# Altium project SPNEX_Payload.PrjPcb (part 3 of 3)
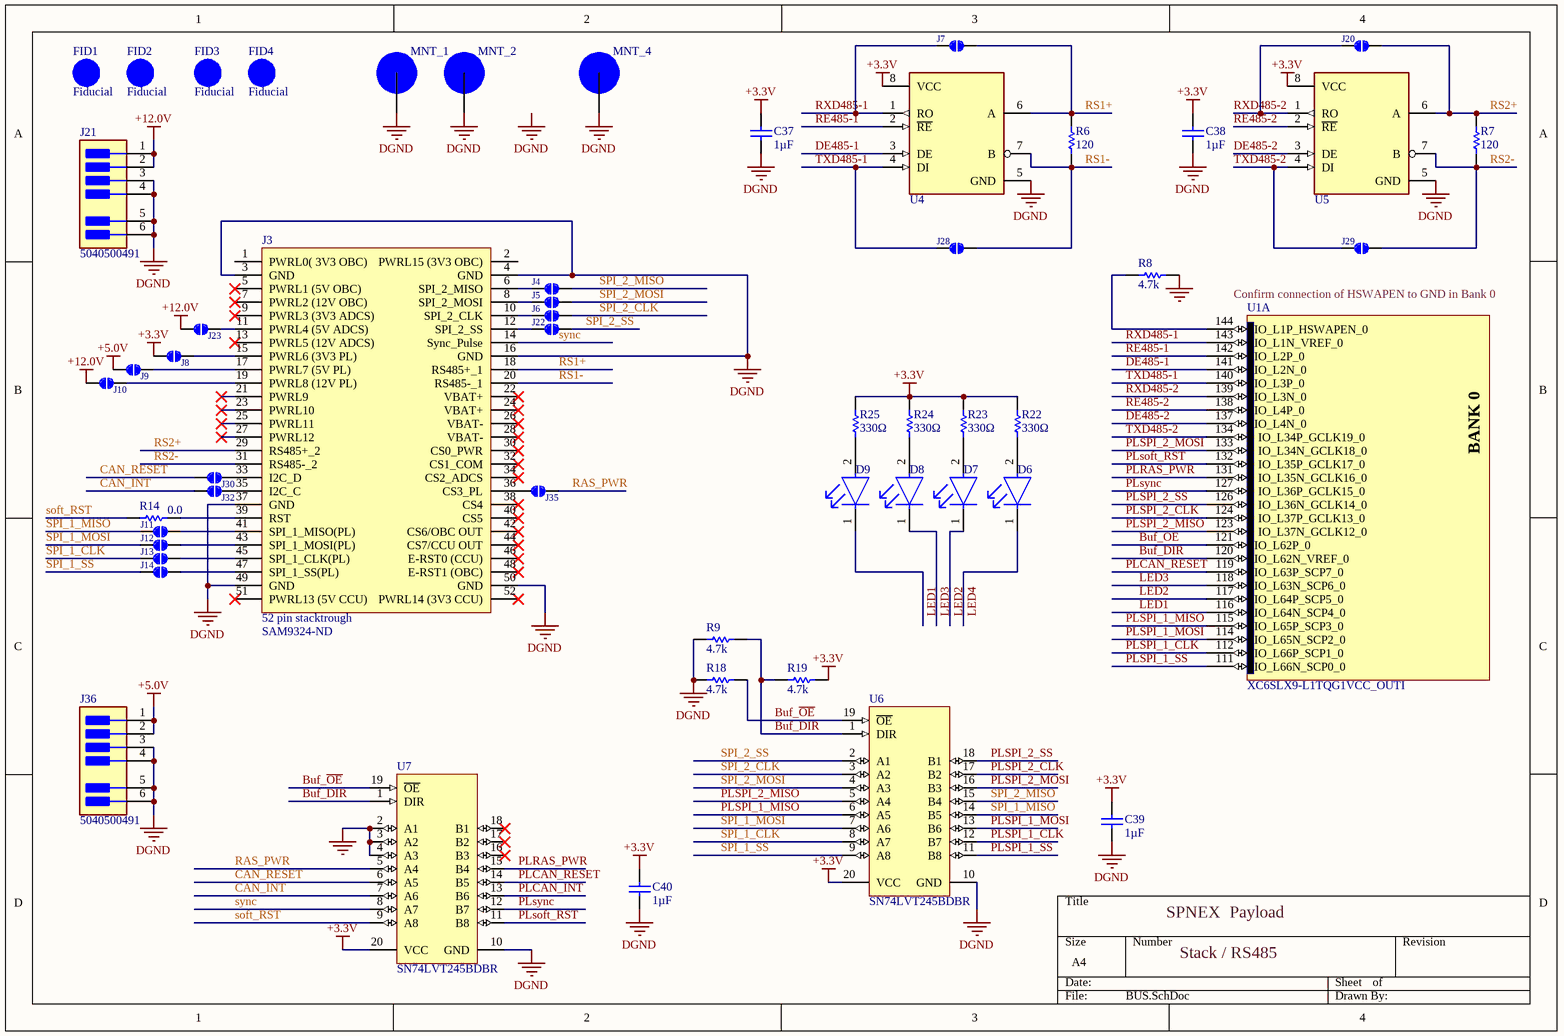
[diagram p6: BUS.SchDoc]

## Nets that join several sheets
+1.8V: FPGA Configuration (U11_FPGA_Configuration.4 U11_FPGA_Configuration.15 U11_FPGA_Configuration.34), Power (9 pins), Serial Camera (U11_Serial_Camera.4 U11_Serial_Camera.15 U11_Serial_Camera.34), SRAM (U11_SRAM.4 U11_SRAM.15 U11_SRAM.34)
+3.3V: FPGA Configuration (33 pins), Power (41 pins), LM Probe (J34_LM_Probe.1 R11_LM_Probe.2 U18_LM_Probe.5), Storage Memory (19 pins), Serial Camera (33 pins), BUS (14 pins), High Resolution Camera (J34_High_Resolution_Camera.1 R11_High_Resolution_Camera.2 U18_High_Resolution_Camera.5), SRAM (33 pins)
+5.0V: FPGA Configuration (J15_FPGA_Configuration.2 J17_FPGA_Configuration.2), Power (C1.2 R2.2), LM Probe (J40_LM_Probe.2), Serial Camera (J15_Serial_Camera.2 J17_Serial_Camera.2), BUS (J9.1 J36.1 J36.2), High Resolution Camera (J40_High_Resolution_Camera.2), SRAM (J15_SRAM.2 J17_SRAM.2)
+12.0V: Power (R1.2), LM Probe (J43_LM_Probe.2), BUS (J10.1 J21.1 J21.2 J23.1), High Resolution Camera (J43_High_Resolution_Camera.2)
DGND: FPGA Configuration (60 pins), Power (56 pins), LM Probe (14 pins), Storage Memory (18 pins), Serial Camera (60 pins), BUS (31 pins), High Resolution Camera (14 pins), SRAM (60 pins)
ADC_CNV: LM Probe (J33_LM_Probe.1 U1_LM_Probe.21), High Resolution Camera (J33_High_Resolution_Camera.1 U1_High_Resolution_Camera.21)
ADC_SCK: LM Probe (J33_LM_Probe.3 U1_LM_Probe.23), High Resolution Camera (J33_High_Resolution_Camera.3 U1_High_Resolution_Camera.23)
ADC_SDO: LM Probe (J33_LM_Probe.2 U1_LM_Probe.22), High Resolution Camera (J33_High_Resolution_Camera.2 U1_High_Resolution_Camera.22)
Buf_~{OE}: FPGA Configuration (R44_FPGA_Configuration.1 U12_FPGA_Configuration.19), Serial Camera (R44_Serial_Camera.1 U12_Serial_Camera.19), BUS (R18.1 U1.121 U6.19 U7.19), SRAM (R44_SRAM.1 U12_SRAM.19)
CCLK: FPGA Configuration (R38_FPGA_Configuration.1 R39_FPGA_Configuration.2 U1_FPGA_Configuration.70 U11_FPGA_Configuration.12), Serial Camera (R38_Serial_Camera.1 R39_Serial_Camera.2 U1_Serial_Camera.70 U11_Serial_Camera.12), SRAM (R38_SRAM.1 R39_SRAM.2 U1_SRAM.70 U11_SRAM.12)
CS1: LM Probe (J33_LM_Probe.4 U1_LM_Probe.24), High Resolution Camera (J33_High_Resolution_Camera.4 U1_High_Resolution_Camera.24)
CS2: LM Probe (J33_LM_Probe.5 U1_LM_Probe.26), High Resolution Camera (J33_High_Resolution_Camera.5 U1_High_Resolution_Camera.26)
DAC_CS: LM Probe (J33_LM_Probe.9 U1_LM_Probe.32), High Resolution Camera (J33_High_Resolution_Camera.9 U1_High_Resolution_Camera.32)
DAC_RST: LM Probe (J33_LM_Probe.8 U1_LM_Probe.30), High Resolution Camera (J33_High_Resolution_Camera.8 U1_High_Resolution_Camera.30)
DAC_SCK: LM Probe (J33_LM_Probe.10 U1_LM_Probe.33), High Resolution Camera (J33_High_Resolution_Camera.10 U1_High_Resolution_Camera.33)
DAC_SDI: LM Probe (J33_LM_Probe.11 U1_LM_Probe.34), High Resolution Camera (J33_High_Resolution_Camera.11 U1_High_Resolution_Camera.34)
DIN: FPGA Configuration (R29_FPGA_Configuration.2 U11_FPGA_Configuration.28), Serial Camera (R29_Serial_Camera.2 U11_Serial_Camera.28), SRAM (R29_SRAM.2 U11_SRAM.28)
FPGA-Done: FPGA Configuration (R32_FPGA_Configuration.1 U1_FPGA_Configuration.71 U11_FPGA_Configuration.13), Serial Camera (R32_Serial_Camera.1 U1_Serial_Camera.71 U11_Serial_Camera.13), SRAM (R32_SRAM.1 U1_SRAM.71 U11_SRAM.13)
FPGA-TCK: FPGA Configuration (R33_FPGA_Configuration.1 U1_FPGA_Configuration.109 U11_FPGA_Configuration.20), Serial Camera (R33_Serial_Camera.1 U1_Serial_Camera.109 U11_Serial_Camera.20), SRAM (R33_SRAM.1 U1_SRAM.109 U11_SRAM.20)
FPGA-TDI: FPGA Configuration (R36_FPGA_Configuration.1 U1_FPGA_Configuration.110), Serial Camera (R36_Serial_Camera.1 U1_Serial_Camera.110), SRAM (R36_SRAM.1 U1_SRAM.110)
FPGA-TDO: FPGA Configuration (R34_FPGA_Configuration.1 U11_FPGA_Configuration.22), Serial Camera (R34_Serial_Camera.1 U11_Serial_Camera.22), SRAM (R34_SRAM.1 U11_SRAM.22)
FPGA-TMS: FPGA Configuration (R35_FPGA_Configuration.1 U1_FPGA_Configuration.107 U11_FPGA_Configuration.21), Serial Camera (R35_Serial_Camera.1 U1_Serial_Camera.107 U11_Serial_Camera.21), SRAM (R35_SRAM.1 U1_SRAM.107 U11_SRAM.21)
INIT_B: FPGA Configuration (R37_FPGA_Configuration.2 U1_FPGA_Configuration.39 U11_FPGA_Configuration.11), Serial Camera (R37_Serial_Camera.2 U1_Serial_Camera.39 U11_Serial_Camera.11), SRAM (R37_SRAM.2 U1_SRAM.39 U11_SRAM.11)
LED4: Storage Memory (U1.80), BUS (D6.1)
M0: FPGA Configuration (R28_FPGA_Configuration.2 U1_FPGA_Configuration.69), Serial Camera (R28_Serial_Camera.2 U1_Serial_Camera.69), SRAM (R28_SRAM.2 U1_SRAM.69)
M1: FPGA Configuration (R31_FPGA_Configuration.2 U1_FPGA_Configuration.60), Serial Camera (R31_Serial_Camera.2 U1_Serial_Camera.60), SRAM (R31_SRAM.2 U1_SRAM.60)
OSCCLK: FPGA Configuration (U1_FPGA_Configuration.51 Y1_FPGA_Configuration.3), Serial Camera (U1_Serial_Camera.51 Y1_Serial_Camera.3), SRAM (U1_SRAM.51 Y1_SRAM.3)
PLCAN_INT: LM Probe (U1_LM_Probe.14), BUS (U7.13), High Resolution Camera (U1_High_Resolution_Camera.14)
PWG1: LM Probe (U1_LM_Probe.15 U18_LM_Probe.7), High Resolution Camera (U1_High_Resolution_Camera.15 U18_High_Resolution_Camera.7)
PWG2: FPGA Configuration (U1_FPGA_Configuration.55 U8_FPGA_Configuration.7), Serial Camera (U1_Serial_Camera.55 U8_Serial_Camera.7), SRAM (U1_SRAM.55 U8_SRAM.7)
RAS_CS: LM Probe (JVCC_OUT_LM_Probe.4 U1_LM_Probe.6), High Resolution Camera (JVCC_OUT_High_Resolution_Camera.4 U1_High_Resolution_Camera.6)
RAS_GPIO1: LM Probe (JVCC_OUT_LM_Probe.11 U1_LM_Probe.11), High Resolution Camera (JVCC_OUT_High_Resolution_Camera.11 U1_High_Resolution_Camera.11)
RAS_GPIO2: LM Probe (JVCC_OUT_LM_Probe.12 U1_LM_Probe.12), High Resolution Camera (JVCC_OUT_High_Resolution_Camera.12 U1_High_Resolution_Camera.12)
RAS_MISO: LM Probe (JVCC_OUT_LM_Probe.2 U1_LM_Probe.2), High Resolution Camera (JVCC_OUT_High_Resolution_Camera.2 U1_High_Resolution_Camera.2)
RAS_MOSI: LM Probe (JVCC_OUT_LM_Probe.3 U1_LM_Probe.5), High Resolution Camera (JVCC_OUT_High_Resolution_Camera.3 U1_High_Resolution_Camera.5)
RAS_RX1: LM Probe (JVCC_OUT_LM_Probe.6 U1_LM_Probe.8), High Resolution Camera (JVCC_OUT_High_Resolution_Camera.6 U1_High_Resolution_Camera.8)
RAS_RX2: LM Probe (JVCC_OUT_LM_Probe.10 U1_LM_Probe.10), High Resolution Camera (JVCC_OUT_High_Resolution_Camera.10 U1_High_Resolution_Camera.10)
RAS_SCK: LM Probe (JVCC_OUT_LM_Probe.1 U1_LM_Probe.1), High Resolution Camera (JVCC_OUT_High_Resolution_Camera.1 U1_High_Resolution_Camera.1)
RAS_TX1: LM Probe (JVCC_OUT_LM_Probe.5 U1_LM_Probe.7), High Resolution Camera (JVCC_OUT_High_Resolution_Camera.5 U1_High_Resolution_Camera.7)
RAS_TX2: LM Probe (JVCC_OUT_LM_Probe.9 U1_LM_Probe.9), High Resolution Camera (JVCC_OUT_High_Resolution_Camera.9 U1_High_Resolution_Camera.9)
SCAM1_PWR: FPGA Configuration (R13_FPGA_Configuration.1 U1_FPGA_Configuration.64 U8_FPGA_Configuration.6), Serial Camera (R13_Serial_Camera.1 U1_Serial_Camera.64 U8_Serial_Camera.6), SRAM (R13_SRAM.1 U1_SRAM.64 U8_SRAM.6)
SCAM1_PWRO: FPGA Configuration (J24_FPGA_Configuration.4 U8_FPGA_Configuration.3), Serial Camera (J24_Serial_Camera.4 U8_Serial_Camera.3), SRAM (J24_SRAM.4 U8_SRAM.3)
SCAM1_RX: FPGA Configuration (U1_FPGA_Configuration.67 U12_FPGA_Configuration.17), Serial Camera (U1_Serial_Camera.67 U12_Serial_Camera.17), SRAM (U1_SRAM.67 U12_SRAM.17)
SCAM1_RX_P: FPGA Configuration (J24_FPGA_Configuration.2 U12_FPGA_Configuration.3), Serial Camera (J24_Serial_Camera.2 U12_Serial_Camera.3), SRAM (J24_SRAM.2 U12_SRAM.3)
SCAM1_TX: FPGA Configuration (U1_FPGA_Configuration.66 U12_FPGA_Configuration.2), Serial Camera (U1_Serial_Camera.66 U12_Serial_Camera.2), SRAM (U1_SRAM.66 U12_SRAM.2)
SCAM1_TX_P: FPGA Configuration (J24_FPGA_Configuration.1 U12_FPGA_Configuration.18), Serial Camera (J24_Serial_Camera.1 U12_Serial_Camera.18), SRAM (J24_SRAM.1 U12_SRAM.18)
SCAM2_PWR: FPGA Configuration (R21_FPGA_Configuration.1 U9_FPGA_Configuration.6), Storage Memory (U1.74), Serial Camera (R21_Serial_Camera.1 U9_Serial_Camera.6), SRAM (R21_SRAM.1 U9_SRAM.6)
SCAM2_PWRO: FPGA Configuration (J25_FPGA_Configuration.4 U9_FPGA_Configuration.3), Serial Camera (J25_Serial_Camera.4 U9_Serial_Camera.3), SRAM (J25_SRAM.4 U9_SRAM.3)
SCAM2_RX: FPGA Configuration (U1_FPGA_Configuration.45 U12_FPGA_Configuration.15), Serial Camera (U1_Serial_Camera.45 U12_Serial_Camera.15), SRAM (U1_SRAM.45 U12_SRAM.15)
SCAM2_RX_P: FPGA Configuration (J25_FPGA_Configuration.2 U12_FPGA_Configuration.5), Serial Camera (J25_Serial_Camera.2 U12_Serial_Camera.5), SRAM (J25_SRAM.2 U12_SRAM.5)
SCAM2_TX: FPGA Configuration (U1_FPGA_Configuration.46 U12_FPGA_Configuration.4), Serial Camera (U1_Serial_Camera.46 U12_Serial_Camera.4), SRAM (U1_SRAM.46 U12_SRAM.4)
SCAM2_TX_P: FPGA Configuration (J25_FPGA_Configuration.1 U12_FPGA_Configuration.16), Serial Camera (J25_Serial_Camera.1 U12_Serial_Camera.16), SRAM (J25_SRAM.1 U12_SRAM.16)
SCK_TEMP: FPGA Configuration (U1_FPGA_Configuration.59), Storage Memory (J49.2 R20.1 U20.1), Serial Camera (U1_Serial_Camera.59), SRAM (U1_SRAM.59)
SDA_TEMP: FPGA Configuration (U1_FPGA_Configuration.58), Storage Memory (J49.1 R17.1 U20.6), Serial Camera (U1_Serial_Camera.58), SRAM (U1_SRAM.58)
SEL1: LM Probe (J33_LM_Probe.6 U1_LM_Probe.27), High Resolution Camera (J33_High_Resolution_Camera.6 U1_High_Resolution_Camera.27)
SEL2: LM Probe (J33_LM_Probe.7 U1_LM_Probe.29), High Resolution Camera (J33_High_Resolution_Camera.7 U1_High_Resolution_Camera.29)
SRAM1_CS: FPGA Configuration (J31_FPGA_Configuration.4 U1_FPGA_Configuration.38), Serial Camera (J31_Serial_Camera.4 U1_Serial_Camera.38), SRAM (J31_SRAM.4 U1_SRAM.38)
SRAM_CLK: FPGA Configuration (J31_FPGA_Configuration.3 U1_FPGA_Configuration.43), Serial Camera (J31_Serial_Camera.3 U1_Serial_Camera.43), SRAM (J31_SRAM.3 U1_SRAM.43)
SRAM_MISO: FPGA Configuration (J31_FPGA_Configuration.2 U1_FPGA_Configuration.41), Serial Camera (J31_Serial_Camera.2 U1_Serial_Camera.41), SRAM (J31_SRAM.2 U1_SRAM.41)
SRAM_MOSI: FPGA Configuration (J31_FPGA_Configuration.1 U1_FPGA_Configuration.40), Serial Camera (J31_Serial_Camera.1 U1_Serial_Camera.40), SRAM (J31_SRAM.1 U1_SRAM.40)
SW_LM: LM Probe (R42_LM_Probe.1 U1_LM_Probe.16 U18_LM_Probe.6), High Resolution Camera (R42_High_Resolution_Camera.1 U1_High_Resolution_Camera.16 U18_High_Resolution_Camera.6)
SW_LMO: LM Probe (J33_LM_Probe.12 U18_LM_Probe.3), High Resolution Camera (J33_High_Resolution_Camera.12 U18_High_Resolution_Camera.3)
Temp_Sensor: LM Probe (J34_LM_Probe.2 R11_LM_Probe.1 U1_LM_Probe.35), High Resolution Camera (J34_High_Resolution_Camera.2 R11_High_Resolution_Camera.1 U1_High_Resolution_Camera.35)
XBAND_422RX+: FPGA Configuration (J38_FPGA_Configuration.4 R15_FPGA_Configuration.2 U10_FPGA_Configuration.8), Serial Camera (J38_Serial_Camera.4 R15_Serial_Camera.2 U10_Serial_Camera.8), SRAM (J38_SRAM.4 R15_SRAM.2 U10_SRAM.8)
XBAND_422RX-: FPGA Configuration (J38_FPGA_Configuration.5 R15_FPGA_Configuration.1 U10_FPGA_Configuration.7), Serial Camera (J38_Serial_Camera.5 R15_Serial_Camera.1 U10_Serial_Camera.7), SRAM (J38_SRAM.5 R15_SRAM.1 U10_SRAM.7)
XBAND_422TX+: FPGA Configuration (J38_FPGA_Configuration.1 R16_FPGA_Configuration.2 U10_FPGA_Configuration.5), Serial Camera (J38_Serial_Camera.1 R16_Serial_Camera.2 U10_Serial_Camera.5), SRAM (J38_SRAM.1 R16_SRAM.2 U10_SRAM.5)
XBAND_422TX-: FPGA Configuration (J38_FPGA_Configuration.2 R16_FPGA_Configuration.1 U10_FPGA_Configuration.6), Serial Camera (J38_Serial_Camera.2 R16_Serial_Camera.1 U10_Serial_Camera.6), SRAM (J38_SRAM.2 R16_SRAM.1 U10_SRAM.6)
XBAND_CLK: FPGA Configuration (U1_FPGA_Configuration.56 U19_FPGA_Configuration.5), Serial Camera (U1_Serial_Camera.56 U19_Serial_Camera.5), SRAM (U1_SRAM.56 U19_SRAM.5)
XBAND_CLK_n: FPGA Configuration (J37_FPGA_Configuration.5 U19_FPGA_Configuration.3), Serial Camera (J37_Serial_Camera.5 U19_Serial_Camera.3), SRAM (J37_SRAM.5 U19_SRAM.3)
XBAND_CLK_p: FPGA Configuration (J37_FPGA_Configuration.4 U19_FPGA_Configuration.4), Serial Camera (J37_Serial_Camera.4 U19_Serial_Camera.4), SRAM (J37_SRAM.4 U19_SRAM.4)
XBAND_Data: FPGA Configuration (U1_FPGA_Configuration.57 U14_FPGA_Configuration.5), Serial Camera (U1_Serial_Camera.57 U14_Serial_Camera.5), SRAM (U1_SRAM.57 U14_SRAM.5)
XBAND_DATA_n: FPGA Configuration (J37_FPGA_Configuration.1 U14_FPGA_Configuration.3), Serial Camera (J37_Serial_Camera.1 U14_Serial_Camera.3), SRAM (J37_SRAM.1 U14_SRAM.3)
XBAND_DATA_p: FPGA Configuration (J37_FPGA_Configuration.2 U14_FPGA_Configuration.4), Serial Camera (J37_Serial_Camera.2 U14_Serial_Camera.4), SRAM (J37_SRAM.2 U14_SRAM.4)
XBAND_GPIO0: FPGA Configuration (J38_FPGA_Configuration.8 U1_FPGA_Configuration.50), Serial Camera (J38_Serial_Camera.8 U1_Serial_Camera.50), SRAM (J38_SRAM.8 U1_SRAM.50)
XBAND_GPIO1: FPGA Configuration (J38_FPGA_Configuration.7 U1_FPGA_Configuration.48), Serial Camera (J38_Serial_Camera.7 U1_Serial_Camera.48), SRAM (J38_SRAM.7 U1_SRAM.48)
XBAND_GPIO2: FPGA Configuration (J38_FPGA_Configuration.9 U1_FPGA_Configuration.47), Serial Camera (J38_Serial_Camera.9 U1_Serial_Camera.47), SRAM (J38_SRAM.9 U1_SRAM.47)
XBAND_RS_RX: FPGA Configuration (U1_FPGA_Configuration.61 U10_FPGA_Configuration.2), Serial Camera (U1_Serial_Camera.61 U10_Serial_Camera.2), SRAM (U1_SRAM.61 U10_SRAM.2)
XBAND_RS_TX: FPGA Configuration (U1_FPGA_Configuration.62 U10_FPGA_Configuration.3), Serial Camera (U1_Serial_Camera.62 U10_Serial_Camera.3), SRAM (U1_SRAM.62 U10_SRAM.3)